# Altium schematic sheet Sheet1.SchDoc
size A4
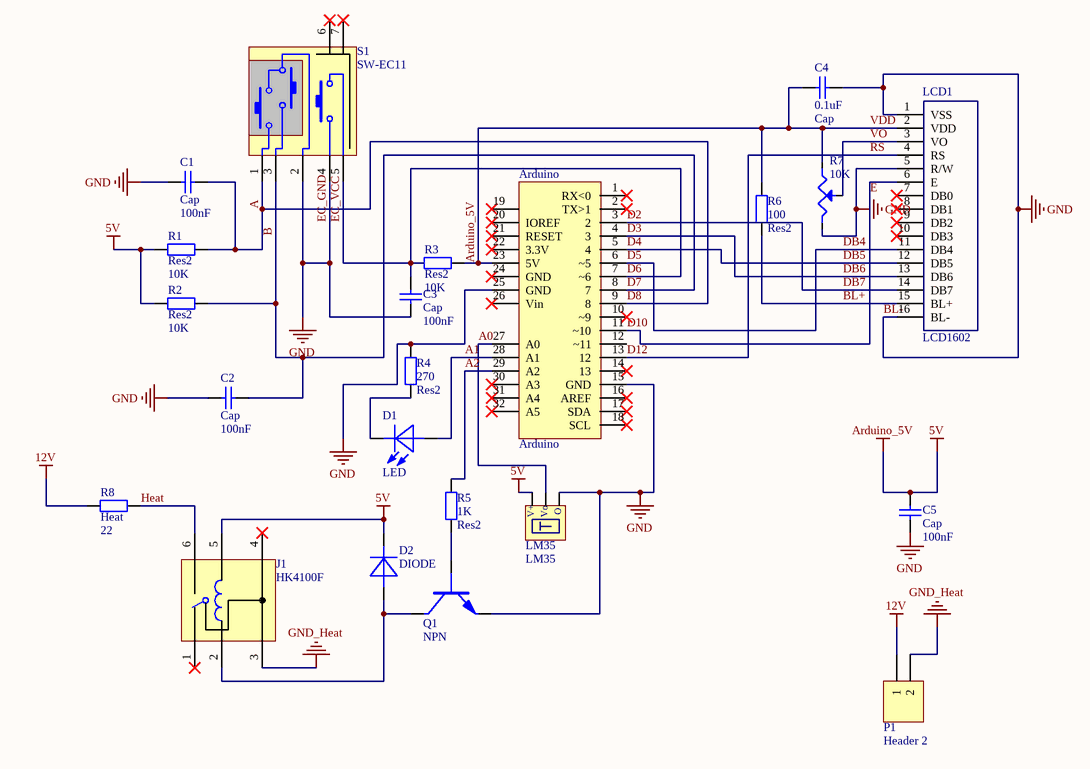
[diagram p0: Sheet1.SchDoc]

## Parts
Arduino  Arduino  [Arduino-UNO]
C1  Cap  value 100nF  [RAD-0.3]
C2  Cap  value 100nF  [RAD-0.3]
C3  Cap  value 100nF  [RAD-0.3]
C4  Cap  value 0.1uF  [RAD-0.3]
C5  Cap  value 100nF  [RAD-0.3]
D1  LED  [LEDLXH-5]
D2  DIODE  [DIODE-4]
J1  HK4100F  [HK4100F]
LCD1  LCD1602  [LCD1602]
LM35  LM35  [LM35]
P1  Header 2  [POWER PLUG2]
Q1  NPN  [NPN-2]
R1  Res2  value 10K  [AXIAL-0.4]
R2  Res2  value 10K  [AXIAL-0.4]
R3  Res2  value 10K  [AXIAL-0.4]
R4  Res2  value 270  [AXIAL-0.4]
R5  Res2  value 1K  [AXIAL-0.4]
R6  Res2  value 100  [AXIAL-0.4]
R7  10K  [VR-5]
R8  Heat  value 22  [AXIAL4cm]
S1  SW-EC11  [EC11]

## Nets
12V: P1.1 R8.2
Arduino_5V: Arduino.23(5V) C4.2 C5.1 D2.2(K) J1.5 LCD1.2(VDD) LM35.1 R1.1 R2.1 R3.2 R6.2 R7.1  [also labelled 5V, VDD]
BL-: Arduino.15(GND) Arduino.25(GND) C1.2 C2.2 C3.1 C4.1 C5.2 LCD1.1(VSS) LCD1.5(R/W) LCD1.16(BL-) LM35.3 Q1.1(E) R4.2 R7.2 S1.2 S1.4  [also labelled EC_GND, GND]
GND_Heat: J1.3 P1.2
A: Arduino.9(8) C1.1 R1.2 S1.1  [also labelled D8]
A0: Arduino.27(A0) LM35.2
A1: Arduino.28(A1) D1.1(A)
A2: Arduino.29(A2) R5.2
B: Arduino.8(7) C2.1 R2.2 S1.3  [also labelled D7]
BL+: LCD1.15(BL+) R6.1
D2: Arduino.3(2) LCD1.14(DB7)  [also labelled DB7]
D3: Arduino.4(3) LCD1.13(DB6)  [also labelled DB6]
D4: Arduino.5(4) LCD1.12(DB5)  [also labelled DB5]
D5: Arduino.6(~5) LCD1.11(DB4)  [also labelled DB4]
D6: Arduino.7(~6) C3.2 R3.1 S1.5  [also labelled EC_VCC]
D10: Arduino.11(~10) LCD1.6(E)  [also labelled E]
D12: Arduino.13(12) LCD1.4(RS)  [also labelled RS]
Heat: J1.6 R8.1
VO: LCD1.3(VO) R7.3(W)
NetD1_2: D1.2(K) R4.1
NetD2_1: D2.1(A) J1.2 Q1.3(C)
NetQ1_2: Q1.2(B) R5.1

Not connected (* = marked no-connect by the designer): Arduino 1(RX<0)* 2(TX>1)* 10(~9)* 12(~11) 14(13)* 16(AREF)* 17(SDA)* 18(SCL)* 19* 20(IOREF)* 21(RESET)* 22(3.3V)* 24(GND)* 26(Vin)* 30(A3)* 31(A4)* 32(A5)*; J1 1* 4*; LCD1 7(DB0)* 8(DB1)* 9(DB2)* 10(DB3)*; S1 6* 7*

## Notes on the sheet
- (in symbol LM35) O; V+; Vo

## Library data of the parts
Arduino = Arduino-UNO
C1-C5 = Cap: Capacitor; Published: 8-Jun-2000; LatestRevisionDate: 17-Jul-2002; LatestRevisionNote: Re-released for DXP Platform.; PackageReference: RAD-0.3; Publisher: Altium Limited
D1 = LEDLXH: 发光二极管
D2 = DIODELXH
J1 = HK4100F: 单刀双掷继电器
LM35 = LM35: LM35温度传感器
P1 = Header 2: Header, 2-Pin; LatestRevisionDate: 17-Jul-2002; LatestRevisionNote: Re-released for DXP Platform.; Publisher: Altium Limited
Q1 = NPNLXH: NPN Transistor
R1-R6 R8 = Res2: Resistor; Published: 8-Jun-2000; LatestRevisionDate: 17-Jul-2002; LatestRevisionNote: Re-released for DXP Platform.; PackageReference: AXIAL-0.4; Publisher: Altium Limited
R7 = POT1: Potentiometer
S1 = SW-EC11: 旋转编码开关; Published: 24-Mar-1999; LatestRevisionDate: 17-Jul-2002; LatestRevisionNote: Re-released for DXP Platform.; PackageReference: SPST-2; Publisher: Altium Limited